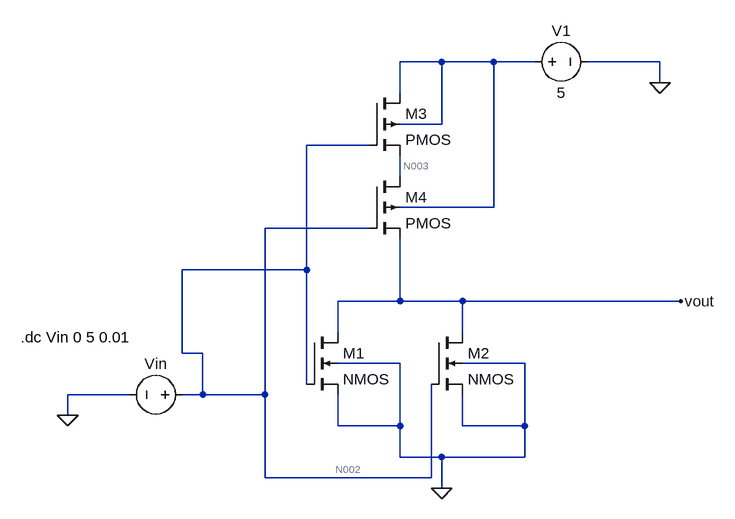
[diagram p0: schematic nor.asc]
nor.asc, the LTspice schematic file:
Version 4.1
SHEET 1 880 680
WIRE 320 -288 256 -288
WIRE 400 -288 320 -288
WIRE 464 -288 400 -288
WIRE 656 -288 544 -288
WIRE 656 -256 656 -288
WIRE 256 -240 256 -288
WIRE 320 -192 320 -288
WIRE 320 -192 256 -192
WIRE 208 -160 112 -160
WIRE 256 -112 256 -144
WIRE 400 -64 400 -288
WIRE 400 -64 256 -64
WIRE 208 -32 48 -32
WIRE 112 32 112 -160
WIRE 112 32 -80 32
WIRE 256 80 256 -16
WIRE 256 80 160 80
WIRE 352 80 256 80
WIRE 688 80 352 80
WIRE 160 128 160 80
WIRE 352 128 352 80
WIRE -80 160 -80 32
WIRE -48 160 -80 160
WIRE 256 176 160 176
WIRE 448 176 352 176
WIRE 112 208 112 32
WIRE -160 224 -256 224
WIRE -48 224 -48 160
WIRE -48 224 -80 224
WIRE 48 224 48 -32
WIRE 48 224 -48 224
WIRE -256 256 -256 224
WIRE 160 272 160 224
WIRE 256 272 256 176
WIRE 256 272 160 272
WIRE 352 272 352 224
WIRE 448 272 448 176
WIRE 448 272 352 272
WIRE 256 320 256 272
WIRE 320 320 256 320
WIRE 448 320 448 272
WIRE 448 320 320 320
WIRE 48 352 48 224
WIRE 304 352 304 208
WIRE 304 352 48 352
WIRE 320 368 320 320
FLAG 320 368 0
FLAG 656 -256 0
FLAG 688 80 vout
FLAG -256 256 0
SYMBOL nmos4 112 128 R0
SYMATTR InstName M1
SYMBOL nmos4 304 128 R0
SYMATTR InstName M2
SYMBOL pmos4 208 -240 R0
SYMATTR InstName M3
SYMBOL pmos4 208 -112 R0
SYMATTR InstName M4
SYMBOL voltage 448 -288 R270
WINDOW 0 32 56 VTop 2
WINDOW 3 -32 56 VBottom 2
WINDOW 123 0 0 Left 0
WINDOW 39 0 0 Left 0
SYMATTR InstName V1
SYMATTR Value 5
SYMBOL voltage -64 224 R90
WINDOW 0 -32 56 VBottom 2
WINDOW 3 32 56 VTop 2
WINDOW 123 0 0 Left 0
WINDOW 39 0 0 Left 0
SYMATTR InstName Vin
SYMATTR Value ""
TEXT -328 136 Left 2 !.dc Vin 0 5 0.01

The netlist it stands for:
* nor.asc
M1 vout N002 0 0 NMOS
M2 vout N002 0 0 NMOS
M3 N001 N002 N003 N001 PMOS
M4 N003 N002 vout N001 PMOS
V1 N001 0 5
Vin N002 0
.model NMOS NMOS
.model PMOS PMOS
.lib standard.mos
.dc Vin 0 5 0.01
.backanno
.end

* Results of the author's LTspice run, read from the files saved beside the schematic
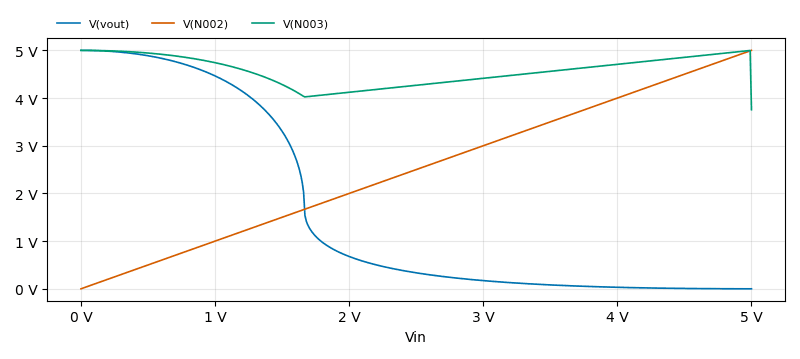
[diagram p1: DC transfer characteristic of nor.asc, plotted from the saved traces]
* DC transfer characteristic, 1 run:
*   V(vout): 5 V at Vin=0 V, 43.83 nV at Vin=5 V, min 43.83 nV, max 5 V
*   V(N002): 0 V at Vin=0 V, 5 V at Vin=5 V, min 0 V, max 5 V
*   V(N003): 5 V at Vin=0 V, 3.755 V at Vin=5 V, min 3.755 V, max 5 V